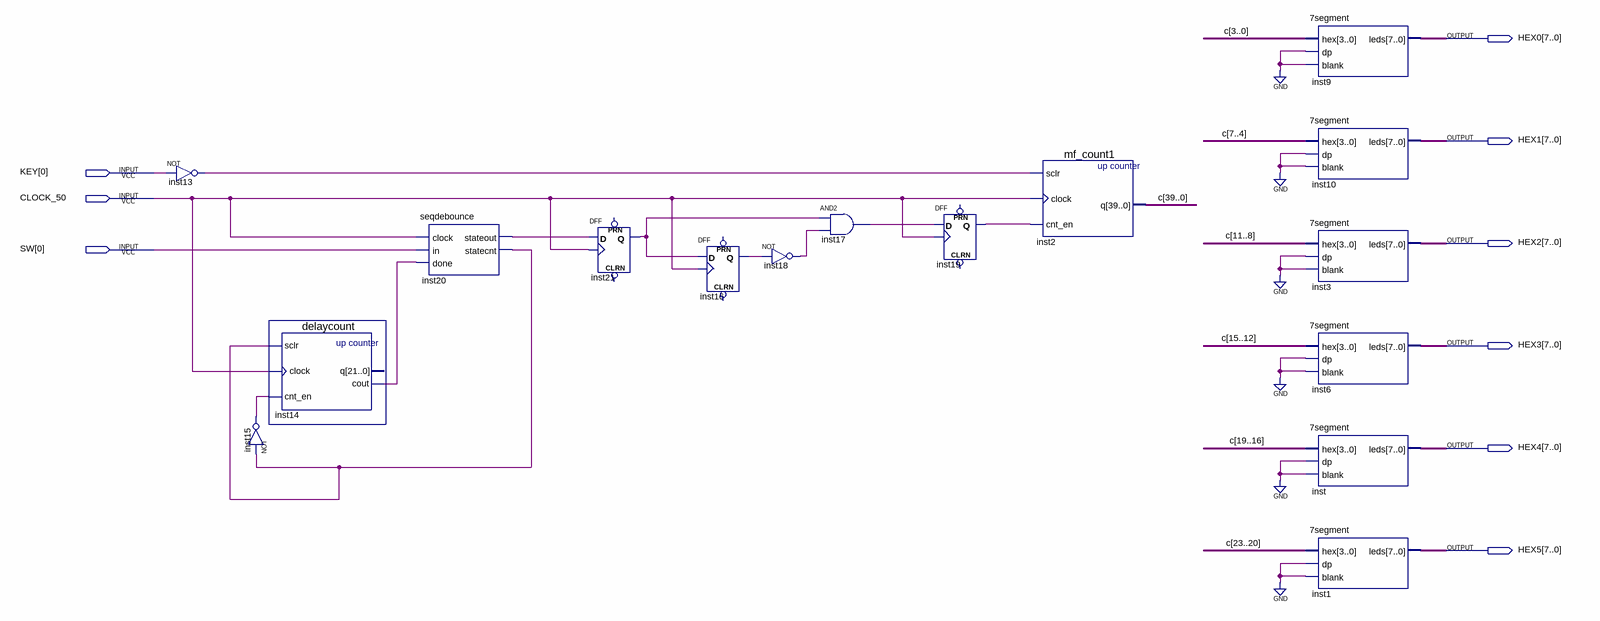
[diagram p0: schematic sheet]
// Quartus schematic Counter.bdf as structural Verilog: 16 symbols, 9 pins
module Counter (
  input  [0:0] KEY,
  input  CLOCK_50,
  input  [0:0] SW,
  output [7:0] HEX0,
  output [7:0] HEX1,
  output [7:0] HEX2,
  output [7:0] HEX3,
  output [7:0] HEX4,
  output [7:0] HEX5
);

  wire inst13_out, inst14_cout, inst15_out, inst16_q, inst17_out, inst18_out, inst19_q, inst20_statecnt,
       inst20_stateout, inst21_q;
  wire [39:0] c;

  not inst13 (inst13_out, KEY[0]);
  not inst15 (inst15_out, inst20_statecnt);
  delaycount inst14 (.sclr(inst20_statecnt), .clock(CLOCK_50), .cnt_en(inst15_out), .cout(inst14_cout));  // open: q
  seqdebounce inst20 (
    .clock(CLOCK_50), .in(SW[0]), .done(inst14_cout), .stateout(inst20_stateout), .statecnt(inst20_statecnt));
  DFF inst21 (.CLK(CLOCK_50), .D(inst20_stateout), .Q(inst21_q));  // open: CLRN, PRN
  DFF inst16 (.CLK(CLOCK_50), .D(inst21_q), .Q(inst16_q));  // open: CLRN, PRN
  not inst18 (inst18_out, inst16_q);
  and inst17 (inst17_out, inst21_q, inst18_out);
  DFF inst19 (.CLK(CLOCK_50), .D(inst17_out), .Q(inst19_q));  // open: CLRN, PRN
  mf_count1 inst2 (.sclr(inst13_out), .clock(CLOCK_50), .cnt_en(inst19_q), .q(c));
  \7segment  inst9 (.hex(c[3:0]), .dp(1'b0), .blank(1'b0), .leds(HEX0));
  \7segment  inst10 (.hex(c[7:4]), .dp(1'b0), .blank(1'b0), .leds(HEX1));
  \7segment  inst3 (.hex(c[11:8]), .dp(1'b0), .blank(1'b0), .leds(HEX2));
  \7segment  inst6 (.hex(c[15:12]), .dp(1'b0), .blank(1'b0), .leds(HEX3));
  \7segment  inst (.hex(c[19:16]), .dp(1'b0), .blank(1'b0), .leds(HEX4));
  \7segment  inst1 (.hex(c[23:20]), .dp(1'b0), .blank(1'b0), .leds(HEX5));
endmodule
